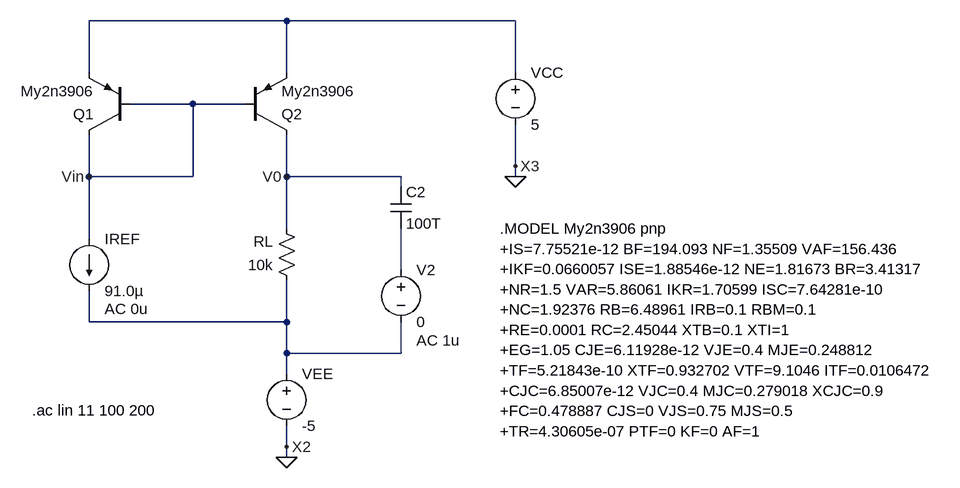
[diagram p0: schematic project3_p2b.asc]
project3_p2b.asc, the LTspice schematic file:
Version 4
SHEET 1 1216 856
WIRE 160 -208 -144 -208
WIRE 512 -208 160 -208
WIRE -144 -128 -144 -208
WIRE 160 -128 160 -208
WIRE 512 -128 512 -208
WIRE 16 -80 -80 -80
WIRE 96 -80 16 -80
WIRE 512 16 512 -48
WIRE -144 32 -144 -32
WIRE 16 32 16 -80
WIRE 16 32 -144 32
WIRE 160 32 160 -32
WIRE 336 32 160 32
WIRE 512 32 512 16
WIRE 336 48 336 32
WIRE 160 112 160 32
WIRE -144 128 -144 32
WIRE 336 176 336 112
WIRE -144 256 -144 208
WIRE 160 256 160 192
WIRE 160 256 -144 256
WIRE 160 304 160 256
WIRE 336 304 336 256
WIRE 336 304 160 304
WIRE 160 336 160 304
WIRE 160 448 160 416
WIRE 160 464 160 448
FLAG 160 464 0
FLAG 512 32 0
FLAG 512 16 X3
FLAG 160 448 X2
FLAG 160 32 V0
FLAG -144 32 Vin
SYMBOL voltage 160 320 R0
SYMATTR InstName VEE
SYMATTR Value -5
SYMBOL voltage 512 -144 R0
WINDOW 123 0 0 Left 0
WINDOW 39 0 0 Left 0
SYMATTR InstName VCC
SYMATTR Value 5
SYMBOL res 176 208 R180
WINDOW 0 36 76 Left 2
WINDOW 3 36 40 Left 2
SYMATTR InstName RL
SYMATTR Value 10k
SYMBOL pnp -80 -32 R180
SYMATTR InstName Q1
SYMATTR Value My2n3906
SYMBOL pnp 96 -32 M180
SYMATTR InstName Q2
SYMATTR Value My2n3906
SYMBOL current -144 128 R0
WINDOW 123 24 108 Left 2
WINDOW 39 0 0 Left 0
SYMATTR Value2 AC 0u
SYMATTR InstName IREF
SYMATTR Value 91.0µ
SYMBOL cap 320 48 R0
SYMATTR InstName C2
SYMATTR Value 100T
SYMBOL voltage 336 160 R0
WINDOW 123 24 124 Left 2
WINDOW 39 0 0 Left 0
SYMATTR InstName V2
SYMATTR Value 0
SYMATTR Value2 AC 1u
TEXT 488 112 Left 2 !.MODEL My2n3906 pnp\n+IS=7.75521e-12 BF=194.093 NF=1.35509 VAF=156.436\n+IKF=0.0660057 ISE=1.88546e-12 NE=1.81673 BR=3.41317\n+NR=1.5 VAR=5.86061 IKR=1.70599 ISC=7.64281e-10\n+NC=1.92376 RB=6.48961 IRB=0.1 RBM=0.1\n+RE=0.0001 RC=2.45044 XTB=0.1 XTI=1\n+EG=1.05 CJE=6.11928e-12 VJE=0.4 MJE=0.248812\n+TF=5.21843e-10 XTF=0.932702 VTF=9.1046 ITF=0.0106472\n+CJC=6.85007e-12 VJC=0.4 MJC=0.279018 XCJC=0.9\n+FC=0.478887 CJS=0 VJS=0.75 MJS=0.5\n+TR=4.30605e-07 PTF=0 KF=0 AF=1
TEXT -232 392 Left 2 !.ac lin 11 100 200

The netlist it stands for:
* project3_p2b.asc
VEE N003 0 -5
VCC N001 0 5
RL N003 V0 10k
Q1 Vin Vin N001 0 My2n3906
Q2 V0 Vin N001 0 My2n3906
IREF Vin N003 91.0µ AC 0u
C2 V0 N002 100T
V2 N002 N003 0 AC 1u
.model NPN NPN
.model PNP PNP
.lib standard.bjt
.MODEL My2n3906 pnp
+IS=7.75521e-12 BF=194.093 NF=1.35509 VAF=156.436
+IKF=0.0660057 ISE=1.88546e-12 NE=1.81673 BR=3.41317
+NR=1.5 VAR=5.86061 IKR=1.70599 ISC=7.64281e-10
+NC=1.92376 RB=6.48961 IRB=0.1 RBM=0.1
+RE=0.0001 RC=2.45044 XTB=0.1 XTI=1
+EG=1.05 CJE=6.11928e-12 VJE=0.4 MJE=0.248812
+TF=5.21843e-10 XTF=0.932702 VTF=9.1046 ITF=0.0106472
+CJC=6.85007e-12 VJC=0.4 MJC=0.279018 XCJC=0.9
+FC=0.478887 CJS=0 VJS=0.75 MJS=0.5
+TR=4.30605e-07 PTF=0 KF=0 AF=1
.ac lin 11 100 200
.backanno
.end